# Altium schematic sheet Analog.SchDoc
size 381 x 241 mm; SheetNumber: 2; SheetTotal: 2
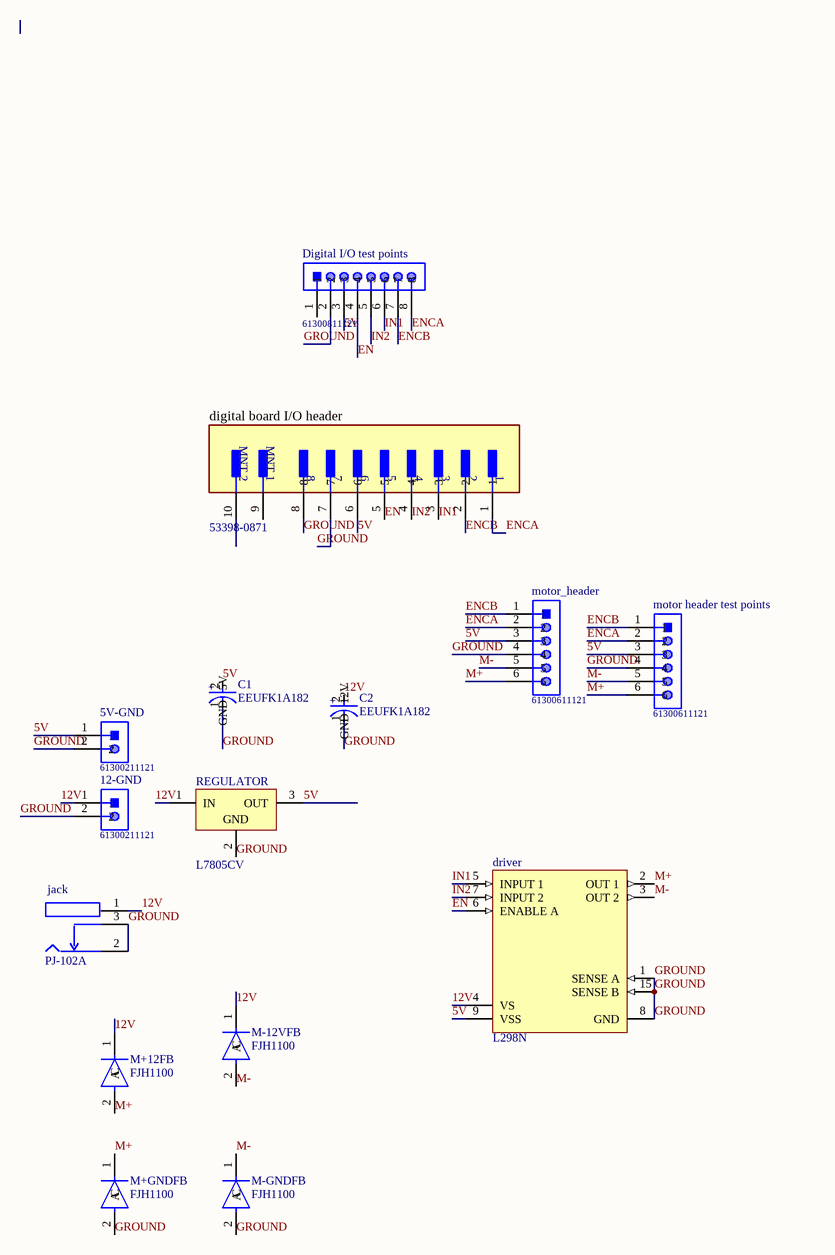
[diagram p0: Analog.SchDoc]

## Parts
5V-GND  61300211121  [61300211121]
12-GND  61300211121  [61300211121]
C1  EEUFK1A182  [FP-RAD-TH-D_10_0_5-L_20_2-MFG]
C2  EEUFK1A182  [FP-RAD-TH-D_10_0_5-L_20_2-MFG]
digital_board_I/O_header  53398-0871  [FP-53398-0871-MFG]
Digital_I/O_test_points  61300811121  [61300811121]
driver  L298N  [STM-FM-15]
jack  PJ-102A  [FP-PJ-102A-MFG]
M+12FB  FJH1100  [FP-017AG-MFG]
M+GNDFB  FJH1100  [FP-017AG-MFG]
M-12VFB  FJH1100  [FP-017AG-MFG]
M-GNDFB  FJH1100  [FP-017AG-MFG]
motor_header  61300611121  [61300611121]
motor_header_test_points  61300611121  [61300611121]
REGULATOR  L7805CV  [TO220]

## Nets
5V: 5V-GND.1 C1.2(GND) digital_board_I/O_header.6 Digital_I/O_test_points.3 driver.9(VSS) motor_header.3 motor_header_test_points.3 REGULATOR.3(OUT)
12V: 12-GND.1 C2.2(GND) driver.4(VS) jack.1 M+12FB.1(C) M-12VFB.1(C) REGULATOR.1(IN)
EN: digital_board_I/O_header.5 Digital_I/O_test_points.4 driver.6(ENABLE_A)
ENCA: digital_board_I/O_header.1 Digital_I/O_test_points.8 motor_header.2 motor_header_test_points.2
ENCB: digital_board_I/O_header.2 Digital_I/O_test_points.7 motor_header.1 motor_header_test_points.1
GROUND: 5V-GND.2 12-GND.2 C1.1(5V) C2.1(12V) digital_board_I/O_header.7 digital_board_I/O_header.8 Digital_I/O_test_points.2 driver.1(SENSE_A) driver.8(GND) driver.15(SENSE_B) jack.2 jack.3 M+GNDFB.2(A) M-GNDFB.2(A) motor_header.4 motor_header_test_points.4 REGULATOR.2(GND)
IN1: digital_board_I/O_header.3 Digital_I/O_test_points.6 driver.5(INPUT_1)
IN2: digital_board_I/O_header.4 Digital_I/O_test_points.5 driver.7(INPUT_2)
M+: driver.2(OUT_1) M+12FB.2(A) M+GNDFB.1(C) motor_header.6 motor_header_test_points.6
M-: driver.3(OUT_2) M-12VFB.2(A) M-GNDFB.1(C) motor_header.5 motor_header_test_points.5

Not connected (* = marked no-connect by the designer): digital_board_I/O_header 9(MNT_1) 10(MNT_2); Digital_I/O_test_points 1

## Notes on the sheet
- (in symbol CMP-05427-000951-1) +

## Library data of the parts
5V-GND 12-GND = CMP-1712-00002-4: THT Vertical Pin Header WR-PHD, Pitch 2.54 mm, Single Row, 2 pins; Manufacturer: Wurth Elektronik; Rated Current: 3A; Gender: Male; Withstanding Voltage: 500VAC; Working Voltage: 250VAC; Pitch: 2.54mm; Contact Resistance: 20mOhm; Pin Number: 2; Mounting Technology: THT; Orientation: Vertical; Operating Temperature: -40to105degC; Packaging: Bag; Publisher: WurthElektronik; Datasheet URL: https://katalog.we-online.de/em/datasheet/6130xx11121.pdf; Manufacturer URL: http://www.we-online.de; Row Number: Single; Package Reference: 61300211121; Part Number: 61300211121
C1 C2 = CMP-05427-000951-1: Aluminum Electrolytic Capacitors (Radial Lead Type) AEC-Q200 Qualified 1800uF ±20% 10V; Life (Hours): 4000Hour; Lead Diameter: 0.6mm; Ripple Current: 1.49A; Dielectric Material: Aluminium; Dissipation Factor: 0.19%; Lead/Base Style: Straight; Capacitance: 1.8mF; Mount: Through Hole; Tolerance: 20%; Diameter: 10mm; Construction: RADIAL; Termination: Radial; Voltage: 10V; Max Operating Temperature: 105°C; REACH SVHC: No SVHC; Voltage Rating: 10V; RoHS Compliant: Yes; Package Quantity: 200; Packaging: Bulk; Height: 20mm; Radiation Hardening: No; Case/Package: Radial; Length: 20mm; Min Operating Temperature: -55°C; Lead Pitch: 5mm; Voltage Rating (DC): 10V; Series: FK
digital_board_I/O_header = CMP-04776-000009-1: CONN HEADER SMD 8POS 1.25MM; Manufacturer: Molex; Current Rating: 1A; Conn Gender: Male; Number Of Contacts: 8; Standoff Height: 0.05mm; Voltage Rating: 125V; Conn Orientation: Vertical; Package: 0; Lead Free: Yes; Number Of Rows: 1; Device Class L1: Connectors; Pitch: 1.25mm; Temperature Range High: +105°C; Automotive: No; ComponentLink2Description: Datasheet; Temperature Range Low: -40°C; RoHS: TRUE; Mouser Description: Headers & Wire Housings VERTICAL HDR SMT 8P; Ambient Temperature Range Low: -40°C; Octopart: https://octopart.com/53398-0871-molex-655298; Device Class L2: Headers and Wire Housings; Temperature: -40°C to +105°C; Footprint Url: https://www.molex.com/pdm_docs/sd/533980871_sd.pdf; Device Class L3: unset; ComponentLink2URL: https://www.molex.com/pdm_docs/ps/PS-51021-024-001.pdf; Contact Material: Tin,Nickel; Ambient Temperature Range High: +105°C; Height: 4.9mm; Manufacturer Part Number: 53398-0871; Digikey Description: CONN HEADER SMD 8POS 1.25MM; Category: Conn
Digital_I/O_test_points = CMP-1502-01076-1: THT Vertical Pin Header WR-PHD, Pitch 2.54 mm, Single Row, 8 pins; Manufacturer: Wurth Elektronik; Rated Current: 3A; Pin Number: 8; Working Voltage: 250VAC; Gender: Male; Contact Resistance: 20mOhm; Pitch: 2.54mm; Withstanding Voltage: 500VAC; Publisher: WurthElektronik; Operating Temperature: -40to105degC; Orientation: Vertical; Row Number: Single; Part Number: 61300811121; Package Reference: 61300811121; Mounting Technology: THT; Packaging: Bag; Manufacturer URL: http://www.we-online.de; Datasheet URL: https://katalog.we-online.de/em/datasheet/6130xx11121.pdf
driver = CMP-2000-06526-1: Dual Full-Bridge Driver, 4.8 to 46 V, -40 to 150 degC, 15-Pin FM (MW 15L), RoHS, Tube; Manufacturer: STMicroelectronics; PartNumber: L298; Output Current: 2A; Supply Voltage Max: 7V; Driver Case Style: Multiwatt; Supply Voltage Min: 4.5V; No. of Pins: 15Pins; SVHC: NoSVHC(17-Dec-2015); Output Voltage: 46V; No. of Outputs: 4Outputs; Motor Type: FullBridge; MSL: -; Package Description: 15-Pin Flange Mount, Body 5 x 19.6 mm, Pitch 1.27 mm; Datasheet Version: 01/2000; Package Reference: FM-15; Mounting Technology: ThroughHole; Packaging: Each; Automotive Qualification Standard: -; Product Range: -; Datasheet URL: https://datasheet.ciiva.com/15109/getdatasheetpartid-50682-15109332.pdf; Operating Temperature Max: 130°C; Operating Temperature Min: -25°C; Manufacturer URL: http://www.st.com/
jack = CMP-2000-06899-2: CONN PWR JACK 2X5.5MM SOLDER; Manufacturer: CUI; Conn Gender: Male; Voltage: 24V; Industry Recognized Mating Diameter: 2.10mm ID (0.083"), 5.50mm OD (0.217"); Number Of Contacts: 3; Number of Positions/Contacts: 2 Conductors, 3 Contacts; Current Rating: 2.5A; Conn Orientation: Right Angle; ComponentLink2URL: http://www.cui.com/product/resource/pj-102a.pdf; Manufacturer Part Number: PJ-102A; Contact Material: Tin,Nickel; Digikey Description: CONN PWR JACK 2X5.5MM SOLDER; RoHS: TRUE; Height: 11.2mm; Category: Conn; Octopart: https://octopart.com/pj-102a-cui-286936; Device Class L1: Connectors; Automotive: No; Package: PJ-102A; Device Class L2: Power Connectors; Temperature Range Low: -25°C; Temperature: -25°C to +85°C; Mouser Description: DC Power Connectors Power Jacks; Lead Free: Yes; Device Class L3: unset; Voltage Rating: 24V; ComponentLink2Description: Datasheet; Temperature Range High: +85°C
M+12FB M+GNDFB M-12VFB M-GNDFB = CMP-07163-000006-1: DIODE GEN PURP 15V 150MA DO35; Manufacturer: ON Semiconductor; Peak Reverse Current: 0.00001uA; Value: 2pF; Reverse Voltage: 30V; Max Junction Temp: +175°C; Footprint Url: https://www.onsemi.com/pub/Collateral/017AG.PDF; Device Class L2: Diodes; Digikey Description: DIODE GEN PURP 15V 150MA DO35; Mouser Description: Rectifiers Small Signal Diode; Forward Current: 150mA; Lead Free: Yes; Height: 1.91mm; Device Class L1: Discrete Semiconductors; Device Class L3: Rectifier Diodes; Temperature Range High: +175°C; Automotive: No; ComponentLink2Description: Datasheet; Octopart: https://octopart.com/fjh1100-on+semiconductor-84327057; Manufacturer Part Number: FJH1100; RoHS: TRUE; Package: 017AG; Capacitance: 2pF; Temperature: to +175°C; Category: Diode; ComponentLink2URL: https://www.onsemi.com/pub/Collateral/FJH1100-D.pdf
motor_header motor_header_test_points = CMP-1502-01070-1: THT Vertical Pin Header WR-PHD, Pitch 2.54 mm, Single Row, 6 pins; Manufacturer: Wurth Elektronik; Gender: Male; Pin Number: 6; Pitch: 2.54mm; Working Voltage: 250VAC; Rated Current: 3A; Withstanding Voltage: 500VAC; Contact Resistance: 20mOhm; Operating Temperature: -40to105degC; Packaging: Bag; Datasheet URL: https://katalog.we-online.de/em/datasheet/6130xx11121.pdf; Package Reference: 61300611121; Mounting Technology: THT; Publisher: WurthElektronik; Part Number: 61300611121; Manufacturer URL: http://www.we-online.de; Row Number: Single; Orientation: Vertical
REGULATOR = CMP-0244-00483-1: Positive Voltage Regulator, 5V, 3-Pin TO-220; PackageDescription: TO, Thru-Hole, Vertical, Heatsink Mounted; 3 In-Line Leads; Pitch 2.54 mm; ComponentLink2Description: Datasheet; PackageReference: TO220; ComponentLink3URL: http://www.st.com/internet/com/TECHNICAL_RESOURCES/TECHNICAL_LITERATURE/PACKAGE_INFORMATION/CD00004649.pdf; DatasheetVersion: 16/11/2011; ComponentLink1Description: Manufacturer URL; ComponentLink1URL: http://www.st.com; PackageVersion: ver3.0; ComponentLink3Description: Package Specification; ComponentLink2URL: http://www.st.com/internet/com/TECHNICAL_RESOURCES/TECHNICAL_LITERATURE/DATASHEET/CD00000444.pdf